# EAGLE schematic RFM70 (EAGLE 7.2.0)
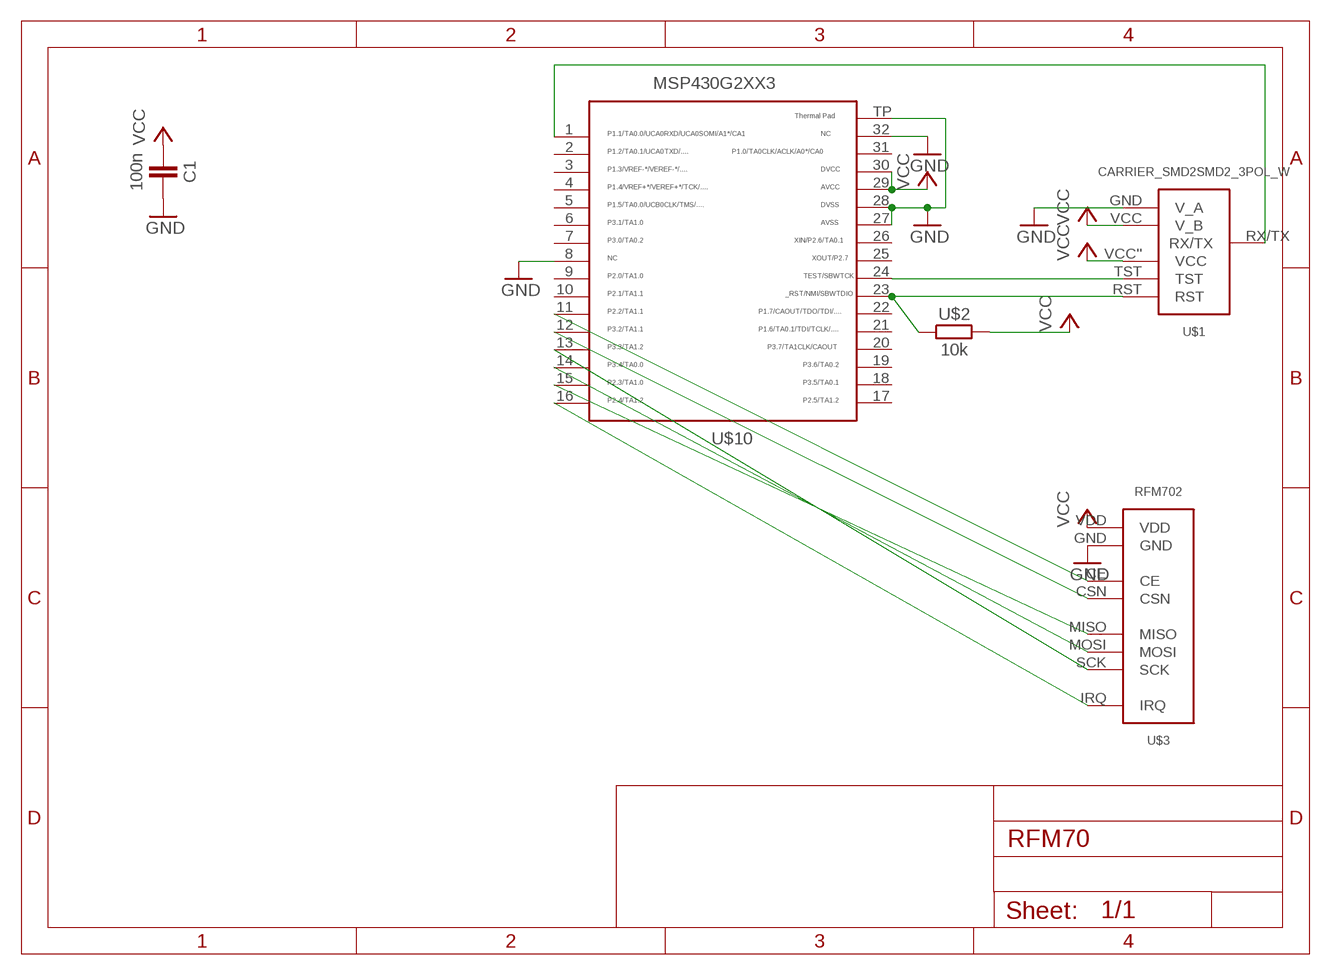
[diagram p0: schematic, sheet 1]

## Parts
C1  100n  CAPACITOR  [603]
U$1  CARRIER_SMD2SMD2_3POL_W  [CARRIER_SMD2_WIDE_3POL]
U$2  10k  RESISTOR0603  [603]
U$3  RFM702  [RFM70_SMD]
U$10  MSP430G2553  [QFN32]

## Nets
GND: C1.2 U$1.GND(V_A) U$3.GND U$10.8 U$10.27 U$10.28 U$10.32 U$10.TP
N$2: U$3.IRQ U$10.16
N$3: U$1.TST U$10.24
N$4: U$1.RST U$2.1 U$10.23
N$5: U$3.MISO U$10.15
N$6: U$3.MOSI U$10.14
N$7: U$3.SCK U$10.13
N$11: U$3.CSN U$10.12
N$12: U$1.RX/TX U$10.1
N$13: U$3.CE U$10.11
VCC: C1.1 U$1.VCC''(VCC) U$1.VCC(V_B) U$2.2 U$3.VDD U$10.29 U$10.30
Unconnected: U$10.2 U$10.3 U$10.4 U$10.5 U$10.6 U$10.7 U$10.9 U$10.10 U$10.17 U$10.18 U$10.19 U$10.20 U$10.21 U$10.22 U$10.25 U$10.26 U$10.31

## Library data of the parts
C1 = thar:CAPACITOR
U$1 = thar:CARRIER_SMD2
U$2 = thar:RESISTOR
U$3 = thar:RFM70: HopeRF RFM70 2,4GHz High Speed FSK Funkmodul, RF Transceiver ... pin compatible with RFM73...
U$10 = thar:MSP430G2553: TEXAS INSTRUMENTS MSP430G2553IRHB32R MCU, 16BIT, MSP430, 16MHZ, QFN-32 Farnell Best.Nr.: 2325726 Herst.Bez.: MSP430G2553IRHB32R